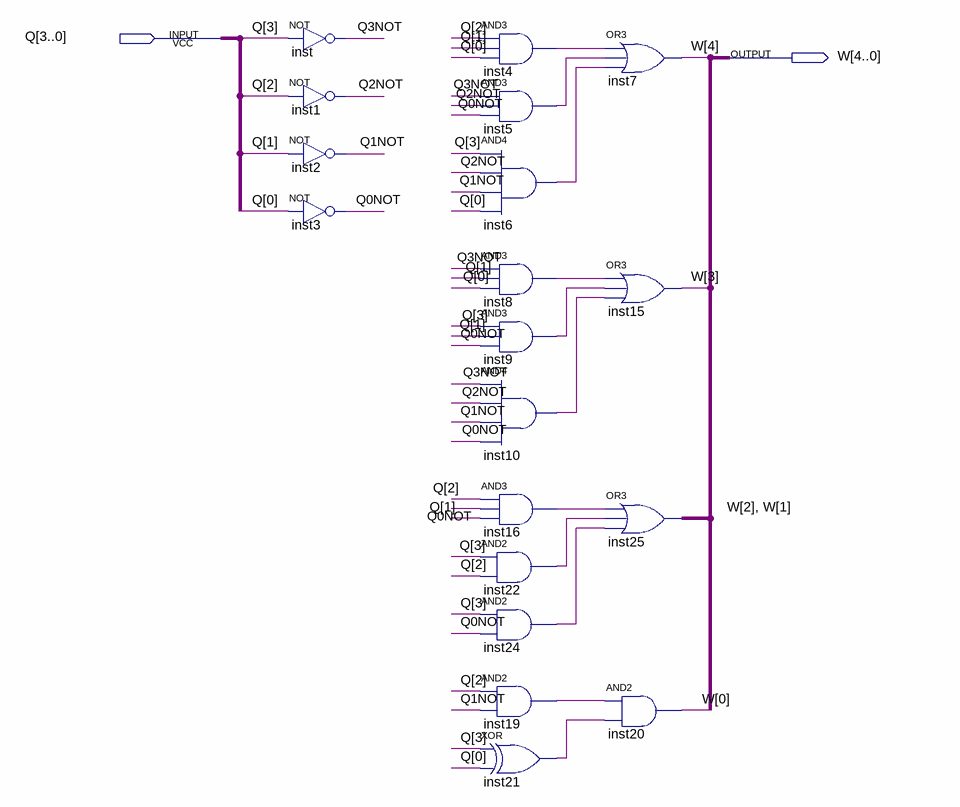
[diagram p0: schematic sheet]
// Quartus schematic DECODE_WRITE.bdf as structural Verilog: 19 symbols, 2 pins
module DECODE_WRITE (
  input  [3:0] Q,
  output [4:0] W
);

  wire inst4_out, inst5_out, inst6_out, inst8_out, inst9_out, inst10_out, inst16_out, inst19_out, inst21_out,
       inst22_out, inst24_out, Q0NOT, Q1NOT, Q2NOT, Q3NOT;

  not inst (Q3NOT, Q[3]);
  not inst1 (Q2NOT, Q[2]);
  not inst2 (Q1NOT, Q[1]);
  not inst3 (Q0NOT, Q[0]);
  and inst4 (inst4_out, Q[2], Q[1], Q[0]);
  and inst5 (inst5_out, Q3NOT, Q2NOT, Q0NOT);
  and inst6 (inst6_out, Q[3], Q2NOT, Q1NOT, Q[0]);
  and inst8 (inst8_out, Q3NOT, Q[1], Q[0]);
  and inst9 (inst9_out, Q[3], Q[1], Q0NOT);
  and inst10 (inst10_out, Q3NOT, Q2NOT, Q1NOT, Q0NOT);
  and inst16 (inst16_out, Q[2], Q[1], Q0NOT);
  and inst22 (inst22_out, Q[3], Q[2]);
  and inst24 (inst24_out, Q[3], Q0NOT);
  and inst19 (inst19_out, Q[2], Q1NOT);
  xor inst21 (inst21_out, Q[3], Q[0]);
  or inst7 (W[4], inst4_out, inst5_out, inst6_out);
  or inst15 (W[3], inst8_out, inst9_out, inst10_out);
  assign W[2:1] = {2{inst16_out}} | {2{inst22_out}} | {2{inst24_out}};  // OR3 inst25, 2 bits wide
  and inst20 (W[0], inst19_out, inst21_out);
endmodule
